# Altium project EVXXXX_02-01243_Drone_ESC_Ref_Design.PrjPCB (part 1 of 4)
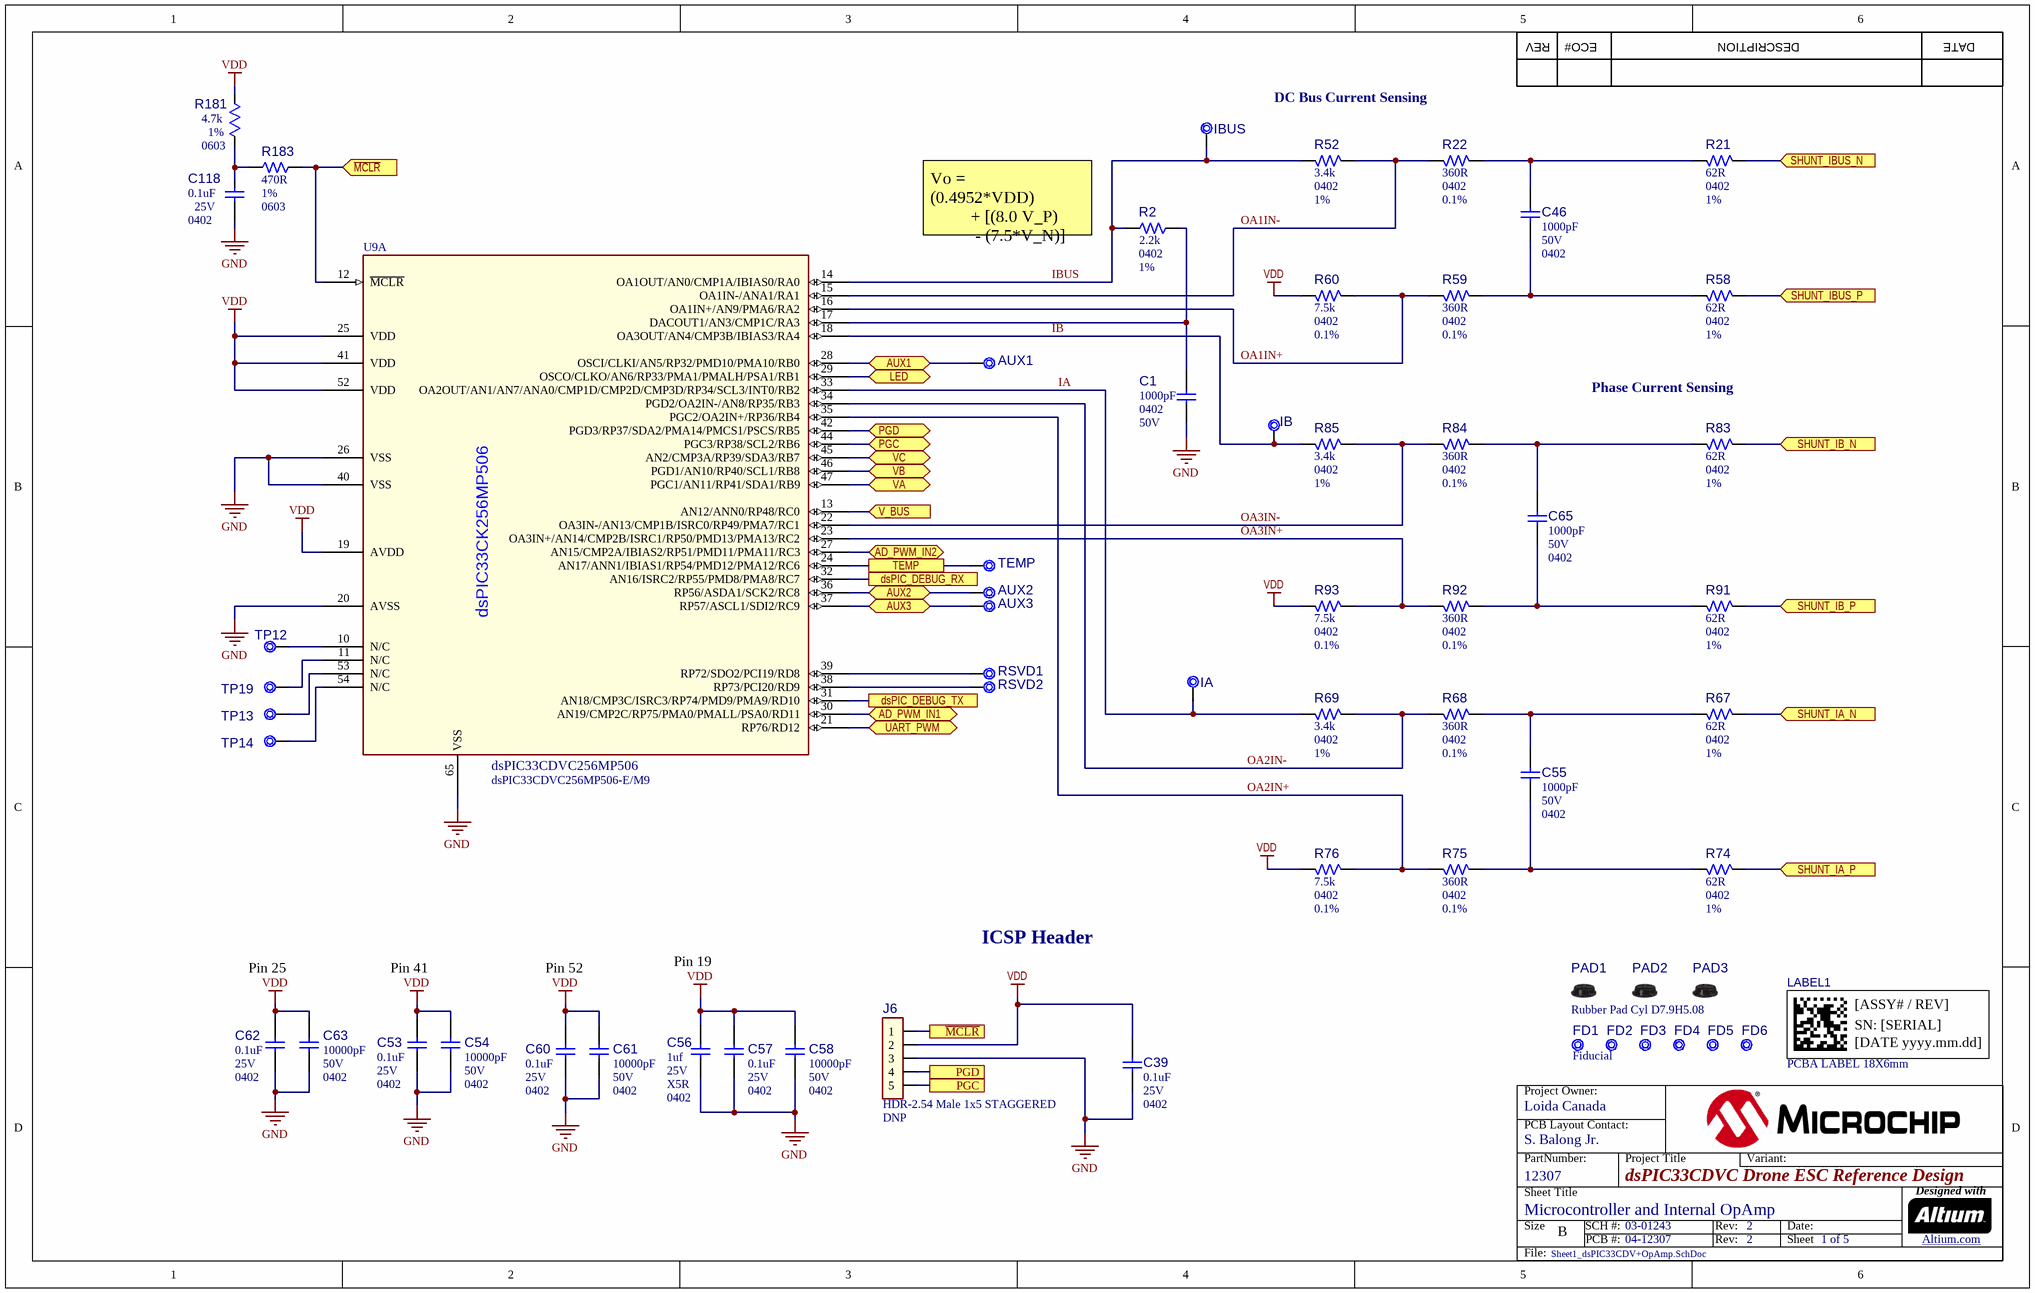
[diagram p0: Sheet1_dsPIC33CDV+OpAmp.SchDoc]
Date: 01-30-2026; ProjectDrawnBy: S. Balong Jr.; ProjectEngineer: Loida Canada; ProjectPartNumber: 12307; ProjectPCBAssyNumber: 01243; ProjectPCBAssyRevision: 2; ProjectPCBFabNumber: 12307; ProjectPCBFabRevision: 2; ProjectPCBNumber: 12307; ProjectRevision: 2; ProjectRevisionART: 2; ProjectRevisionASSY: 2; ProjectRevisionFAB: 2; ProjectRevisionSCH: 2; ProjectTitle: dsPIC33CDVC Drone ESC Reference Design
5 sheets, 174 parts. Net scope: flat (ports and power ports of the same name join across sheets).
Board file: 04-12307_Drone_ESC.PcbDoc
Sheets:
  Sheet1_dsPIC33CDV+OpAmp.SchDoc
  Sheet2_Inverter_GateDriver.SchDoc
  Sheet3_SenseCkts_Programming_Interface.SchDoc
  Sheet4_CAN_Interface.SchDoc
  Sheet5_RevHistory.SchDoc

## Sheet Sheet1_dsPIC33CDV+OpAmp.SchDoc
size B; CompanyName: Microchip Technology Inc.; Organization: Microchip Technology; Address1: 2355 West Chandler Blvd.; Address2: Chandler, AZ  85224; Address4: USA; DocumentNumber: 1; SheetNumber: 1; SheetTotal: 5; SheetTitle: Microcontroller and Internal OpAmp; Time: Time

### Parts
AUX1  Test Point No BOM  [CON_TP_SMD_D25mil_NoSilk]  (value not drawn)  (no BOM)
AUX2  Test Point No BOM  [TP_TH_0.7PADX0.4HOLE]  (value not drawn)  (no BOM)
AUX3  Test Point No BOM  [CON_TP_SMD_D25mil_NoSilk]  (value not drawn)  (no BOM)
C1  value 1000pF  Voltage: 50V  Package: 0402  [CAP_C_0402]  (hidden comment: Capacitor NP)
C39  value 0.1uF  Voltage: 25V  Package: 0402  [CAP_C_0402]  (hidden comment: Capacitor NP)
C46  value 1000pF  Voltage: 50V  Package: 0402  [CAP_C_0402]  (hidden comment: Capacitor NP)
C53  value 0.1uF  Voltage: 25V  Package: 0402  [CAP_C_0402]  (hidden comment: Capacitor NP)
C54  value 10000pF  Voltage: 50V  Package: 0402  [CAP_C_0402]  (hidden comment: Capacitor NP)
C55  value 1000pF  Voltage: 50V  Package: 0402  [CAP_C_0402]  (hidden comment: Capacitor NP)
C56  value 1uf  Voltage: 25V  Package: 0402  Temperature Coefficient: X5R  [CAP_C_0402]  (hidden comment: Capacitor NP)
C57  value 0.1uF  Voltage: 25V  Package: 0402  [CAP_C_0402]  (hidden comment: Capacitor NP)
C58  value 10000pF  Voltage: 50V  Package: 0402  [CAP_C_0402]  (hidden comment: Capacitor NP)
C60  value 0.1uF  Voltage: 25V  Package: 0402  [CAP_C_0402]  (hidden comment: Capacitor NP)
C61  value 10000pF  Voltage: 50V  Package: 0402  [CAP_C_0402]  (hidden comment: Capacitor NP)
C62  value 0.1uF  Voltage: 25V  Package: 0402  [CAP_C_0402]  (hidden comment: Capacitor NP)
C63  value 10000pF  Voltage: 50V  Package: 0402  [CAP_C_0402]  (hidden comment: Capacitor NP)
C65  value 1000pF  Voltage: 50V  Package: 0402  [CAP_C_0402]  (hidden comment: Capacitor NP)
C118  value 0.1uF  Voltage: 25V  Package: 0402  [CAP_C_0402]  (hidden comment: Capacitor NP)
FD1  value Fiducial  [Fiducial_1mm]  (hidden comment: FIDUCIAL ROUND)  (no BOM)
FD2  FIDUCIAL ROUND  [Fiducial_1mm]  (value not drawn)  (no BOM)
FD3  FIDUCIAL ROUND  [Fiducial_1mm]  (value not drawn)  (no BOM)
FD4  FIDUCIAL ROUND  [Fiducial_1mm]  (value not drawn)  (no BOM)
FD5  FIDUCIAL ROUND  [Fiducial_1mm]  (value not drawn)  (no BOM)
FD6  FIDUCIAL ROUND  [Fiducial_1mm]  (value not drawn)  (no BOM)
IA  Test Point No BOM  [CON_TP_SMD_D25mil_NoSilk]  (value not drawn)  (no BOM)
IB  Test Point No BOM  [CON_TP_SMD_D25mil_NoSilk]  (value not drawn)  (no BOM)
IBUS  Test Point No BOM  [TP_TH_0.7PADX0.4HOLE]  (value not drawn)  (no BOM)
J6  value HDR-2.54 Male 1x5 STAGGERED  Populated: DNP  [HDR_M_2.54_1x5_STAGGERED]
LABEL1  value PCBA LABEL 18X6mm  [08-10015]  (hidden comment: 08-10015)
PAD1  value Rubber Pad Cyl D7.9H5.08  [BUMP_3M_SJ61A1_CYLINDRICAL_BLACK_D7.9H5.08]  (hidden comment: Rubber Pad Cylindrical)
PAD2  Rubber Pad Cylindrical  [BUMP_3M_SJ61A1_CYLINDRICAL_BLACK_D7.9H5.08]  (value not drawn)
PAD3  Rubber Pad Cylindrical  [BUMP_3M_SJ61A1_CYLINDRICAL_BLACK_D7.9H5.08]  (value not drawn)
R2  value 2.2k  Package: 0402  Tolerance: 1%  [RES_C_0402]  (hidden comment: Resistor)
R21  value 62R  Package: 0402  Tolerance: 1%  [RES_C_0402]  (hidden comment: Resistor)
R22  value 360R  Package: 0402  Tolerance: 0.1%  [RES_C_0402]  (hidden comment: Resistor)
R52  value 3.4k  Package: 0402  Tolerance: 1%  [RES_C_0402]  (hidden comment: Resistor)
R58  value 62R  Package: 0402  Tolerance: 1%  [RES_C_0402]  (hidden comment: Resistor)
R59  value 360R  Package: 0402  Tolerance: 0.1%  [RES_C_0402]  (hidden comment: Resistor)
R60  value 7.5k  Package: 0402  Tolerance: 0.1%  [RES_C_0402]  (hidden comment: Resistor)
R67  value 62R  Package: 0402  Tolerance: 1%  [RES_C_0402]  (hidden comment: Resistor)
R68  value 360R  Package: 0402  Tolerance: 0.1%  [RES_C_0402]  (hidden comment: Resistor)
R69  value 3.4k  Package: 0402  Tolerance: 1%  [RES_C_0402]  (hidden comment: Resistor)
R74  value 62R  Package: 0402  Tolerance: 1%  [RES_C_0402]  (hidden comment: Resistor)
R75  value 360R  Package: 0402  Tolerance: 0.1%  [RES_C_0402]  (hidden comment: Resistor)
R76  value 7.5k  Package: 0402  Tolerance: 0.1%  [RES_C_0402]  (hidden comment: Resistor)
R83  value 62R  Package: 0402  Tolerance: 1%  [RES_C_0402]  (hidden comment: Resistor)
R84  value 360R  Package: 0402  Tolerance: 0.1%  [RES_C_0402]  (hidden comment: Resistor)
R85  value 3.4k  Package: 0402  Tolerance: 1%  [RES_C_0402]  (hidden comment: Resistor)
R91  value 62R  Package: 0402  Tolerance: 1%  [RES_C_0402]  (hidden comment: Resistor)
R92  value 360R  Package: 0402  Tolerance: 0.1%  [RES_C_0402]  (hidden comment: Resistor)
R93  value 7.5k  Package: 0402  Tolerance: 0.1%  [RES_C_0402]  (hidden comment: Resistor)
R181  value 4.7k  Tolerance: 1%  Package: 0603  [RES_C_0603]  (hidden comment: Resistor)
R183  value 470R  Tolerance: 1%  Package: 0603  [RES_C_0603]  (hidden comment: Resistor)
RSVD1  Test Point No BOM  [CON_TP_SMD_D25mil_NoSilk]  (value not drawn)  (no BOM)
RSVD2  Test Point No BOM  [CON_TP_SMD_D25mil_NoSilk]  (value not drawn)  (no BOM)
TEMP  Test Point No BOM  [TP_TH_0.7PADX0.4HOLE]  (value not drawn)  (no BOM)
TP12  Test Point No BOM  [CON_TP_SMD_D25mil_NoSilk]  (value not drawn)  (no BOM)
TP13  Test Point No BOM  [CON_TP_SMD_D25mil_NoSilk]  (value not drawn)  (no BOM)
TP14  Test Point No BOM  [CON_TP_SMD_D25mil_NoSilk]  (value not drawn)  (no BOM)
TP19  Test Point No BOM  [CON_TP_SMD_D25mil_NoSilk]  (value not drawn)  (no BOM)
U9  value dsPIC33CDVC256MP506-E/M9  [QFN-64_9X9_3EP_M9]  (hidden comment: dsPIC33CDVC256MP506_VGQFN-64)  (part A of 3)

### Ports
AD_PWM_IN1 (bidir), AD_PWM_IN2 (bidir), AUX1 (bidir), AUX2 (bidir), AUX3 (bidir), dsPIC_DEBUG_RX, dsPIC_DEBUG_TX, LED (bidir), PGC, PGC (bidir), PGD, PGD (bidir), SHUNT_IA_N (in), SHUNT_IA_P (in), SHUNT_IB_N (in), SHUNT_IB_P (in), SHUNT_IBUS_N (in), SHUNT_IBUS_P (in), TEMP, UART_PWM (bidir), V_BUS (in), VA (bidir), VB (bidir), VC (bidir), ~{MCLR}, ~{MCLR} (in)

### Nets
GND: C1.2 C39.1 C53.1 C54.1 C56.1 C57.1 C58.1 C60.1 C61.1 C62.1 C63.1 C118.1 J6.3 U9.20(AVSS) U9.26(VSS) U9.40(VSS) U9.65(VSS)
VDD: C39.2 C53.2 C54.2 C56.2 C57.2 C58.2 C60.2 C61.2 C62.2 C63.2 J6.2 R60.2 R76.2 R93.2 R181.1 U9.19(AVDD) U9.25(VDD) U9.41(VDD) U9.52(VDD)
AD_PWM_IN1: U9.30(AN19/CMP2C/RP75/PMA0/PMALL/PSA0/RD11) ; port AD_PWM_IN1
AD_PWM_IN2: U9.27(AN15/CMP2A/IBIAS2/RP51/PMD11/PMA11/RC3) ; port AD_PWM_IN2
AUX1: AUX1.1 U9.28(OSCI/CLKI/AN5/RP32/PMD10/PMA10/RB0) ; port AUX1
AUX2: AUX2.1 U9.36(RP56/ASDA1/SCK2/RC8) ; port AUX2
AUX3: AUX3.1 U9.37(RP57/ASCL1/SDI2/RC9) ; port AUX3
dsPIC_DEBUG_RX: U9.32(AN16/ISRC2/RP55/PMD8/PMA8/RC7) ; port dsPIC_DEBUG_RX
dsPIC_DEBUG_TX: U9.31(AN18/CMP3C/ISRC3/RP74/PMD9/PMA9/RD10) ; port dsPIC_DEBUG_TX
IA: IA.1 R69.2 U9.33(OA2OUT/AN1/AN7/ANA0/CMP1D/CMP2D/CMP3D/RP34/SCL3/INT0/RB2)
IB: IB.1 R85.2 U9.18(OA3OUT/AN4/CMP3B/IBIAS3/RA4)
IBUS: IBUS.1 R2.1 R52.2 U9.14(OA1OUT/AN0/CMP1A/IBIAS0/RA0)
LED: U9.29(OSCO/CLKO/AN6/RP33/PMA1/PMALH/PSA1/RB1) ; port LED
~{MCLR}: J6.1 R183.2 U9.12(~{MCLR}) ; port ~{MCLR}
OA1IN+: R59.2 R60.1 U9.16(OA1IN+/AN9/PMA6/RA2)
OA1IN-: R22.2 R52.1 U9.15(OA1IN-/ANA1/RA1)
OA2IN+: R75.2 R76.1 U9.35(PGC2/OA2IN+/RP36/RB4)
OA2IN-: R68.2 R69.1 U9.34(PGD2/OA2IN-/AN8/RP35/RB3)
OA3IN+: R92.2 R93.1 U9.23(OA3IN+/AN14/CMP2B/ISRC1/RP50/PMD13/PMA13/RC2)
OA3IN-: R84.2 R85.1 U9.22(OA3IN-/AN13/CMP1B/ISRC0/RP49/PMA7/RC1)
PGC: J6.5 U9.44(PGC3/RP38/SCL2/RB6) ; port PGC
PGD: J6.4 U9.42(PGD3/RP37/SDA2/PMA14/PMCS1/PSCS/RB5) ; port PGD
SHUNT_IA_N: R67.1 ; port SHUNT_IA_N
SHUNT_IA_P: R74.1 ; port SHUNT_IA_P
SHUNT_IB_N: R83.1 ; port SHUNT_IB_N
SHUNT_IB_P: R91.1 ; port SHUNT_IB_P
SHUNT_IBUS_N: R21.1 ; port SHUNT_IBUS_N
SHUNT_IBUS_P: R58.1 ; port SHUNT_IBUS_P
TEMP: TEMP.1 U9.24(AN17/ANN1/IBIAS1/RP54/PMD12/PMA12/RC6) ; port TEMP
UART_PWM: U9.21(RP76/RD12) ; port UART_PWM
V_BUS: U9.13(AN12/ANN0/RP48/RC0) ; port V_BUS
VA: U9.47(PGC1/AN11/RP41/SDA1/RB9) ; port VA
VB: U9.46(PGD1/AN10/RP40/SCL1/RB8) ; port VB
VC: U9.45(AN2/CMP3A/RP39/SDA3/RB7) ; port VC
NetC1_1: C1.1 R2.2 U9.17(DACOUT1/AN3/CMP1C/RA3)
NetC46_1: C46.1 R58.2 R59.1
NetC46_2: C46.2 R21.2 R22.1
NetC55_1: C55.1 R74.2 R75.1
NetC55_2: C55.2 R67.2 R68.1
NetC65_1: C65.1 R91.2 R92.1
NetC65_2: C65.2 R83.2 R84.1
NetC118_2: C118.2 R181.2 R183.1
NetRSVD1_1: RSVD1.1 U9.39(RP72/SDO2/PCI19/RD8)
NetRSVD2_1: RSVD2.1 U9.38(RP73/PCI20/RD9)
NetTP12_1: TP12.1 U9.10(N/C)
NetTP13_1: TP13.1 U9.53(N/C)
NetTP14_1: TP14.1 U9.54(N/C)
NetTP19_1: TP19.1 U9.11(N/C)

Not connected (* = marked no-connect by the designer): FD1 1; FD2 1; FD3 1; FD4 1; FD5 1; FD6 1

### Notes on the sheet
- DC Bus Current Sensing
- REV
- ECO#
- DESCRIPTION
- DATE
- (near R2) Vo =    (0.4952*VDD)
  + [(8.0 V_P)
  - (7.5*V_N)]
- (near R84) Phase Current Sensing
- (near U9) dsPIC33CDVC256MP506
- Pin 25
- Pin 41
- Pin 52
- Pin 19
- ICSP Header
- Project Owner:
- PCB Layout Contact:
- PartNumber:
- Project Title
- Variant:
- Sheet Title
- Size
- B
- SCH #:
- PCB #:
- Rev:
- Date:
- Sheet
- Designed with
- Altium.com <http://go.altium.com/MicrochipLandingPage_Evaluation.html>
- File:
- (in symbol 08-10015) [ASSY# / REV]; SN: [SERIAL]; [DATE yyyy.mm.dd]
- (in symbol MIC9437, part A) dsPIC33CK256MP506

### Library data of the parts
AUX1 AUX3 RSVD1 RSVD2 = CON3082: Test Point; Description_: CON TP PAD PCB SMD D25mil; Dev Tools Status: Design; Owner: James Boomer; Populated: YES; Value: TP SMD D25mil; MCHP-ID: CON3082; Revision: 1; Symbol: Test Point No BOM; Status: MCL Design; ComponentLink1Description: SVN Datasheet; ComponentLink2Description: Local Datasheet; ComponentLink3URL: C:\ALTIUM_WORK\00001_MCHP-CDB\Library\LibraryRefs\Test Point No BOM.SchLib; ComponentLink3Description: Open Symbol; ComponentLink4URL: C:\ALTIUM_WORK\00001_MCHP-CDB\Library\Footprints\CON_TP_SMD_D25mil_NoSilk.PcbLib; ComponentLink4Description: Open Footprint; ComponentLink5Description: Open Footprint 2; ComponentLink6Description: Open Footprint 3; ComponentLink7Description: Open Footprint 4; Type: Test Point No BOM; Category: Connector; Quantity Override: 1; Assembly Type: SMD; Restricted Sourcing: No
AUX2 TEMP = CON2938: Test Point; Description_: CON TP PAD PCB TH D0.7H0.4; Dev Tools Status: Design; Owner: Severino Balong Jr.; Populated: DNP; MCHP-ID: CON2938; Revision: 1; Symbol: Test Point No BOM; Status: MCL Design; ComponentLink1Description: SVN Datasheet; ComponentLink2Description: Local Datasheet; ComponentLink3URL: C:\ALTIUM_WORK\00001_MCHP-CDB\Library\LibraryRefs\Test Point No BOM.SchLib; ComponentLink3Description: Open Symbol; ComponentLink4URL: C:\ALTIUM_WORK\00001_MCHP-CDB\Library\Footprints\TP_TH_0.7PADX0.4HOLE.PcbLib; ComponentLink4Description: Open Footprint; ComponentLink5Description: Open Footprint 2; ComponentLink6Description: Open Footprint 3; ComponentLink7Description: Open Footprint 4; Type: Test Point No BOM; Category: Connector; Quantity Override: 1; Assembly Type: TH; Restricted Sourcing: No
C1 C46 C55 C65 = CAP2655: Manufacturer 1: KEMET; Manufacturer Part Number 1: C0402C102J5GAC7867; Description_: CAP CER 1000pF 50V 5% NP0 SMD 0402; Dev Tools Status: Production; Tolerance: 5%; Type: Ceramic; Populated: YES; Temperature Coefficient: C0G, NP0; Owner: Narasimha Murthy; Restricted Sourcing: No; MCHP-ID: CAP2655; Revision: 2; Symbol: Capacitor NP; Status: MCL Design; ComponentLink1URL: https://chn-vm-apps.microchip.com/mchprepo/parts/Datasheets/GRM1555C1H102JA01D.pdf; ComponentLink1Description: SVN Datasheet; ComponentLink2URL: C:\ALTIUM_WORK\00001_MCHP-CDB\Datasheets\GRM1555C1H102JA01D.pdf; ComponentLink2Description: Local Datasheet; ComponentLink3URL: C:\ALTIUM_WORK\00001_MCHP-CDB\Library\LibraryRefs\Capacitor NP.SchLib; ComponentLink3Description: Open Symbol; ComponentLink4URL: C:\ALTIUM_WORK\00001_MCHP-CDB\Library\Footprints\CAP_C_0402.PcbLib; ComponentLink4Description: Open Footprint; ComponentLink5Description: Open Footprint 2; ComponentLink6Description: Open Footprint 3; ComponentLink7Description: Open Footprint 4; Operating Temperature: -55C to +125C; Category: Capacitor; Manufacturer 2: Murata; Manufacturer Part Number 2: GRM1555C1H102JA01D; Supplier 1: Digi-Key; Supplier Part Number 1: 399-C0402C102J5GAC7867TR-ND; Supplier 2: Digi-Key; Supplier Part Number 2: 490-3244-2-ND; Quantity Override: 1
C39 C53 C57 C60 C62 C118 = CAP1345: Manufacturer 1: TDK Corporation; Manufacturer Part Number 1: C1005X7R1E104K050BB; Description_: CAP CER 0.1uF 25V 10% X7R SMD 0402; Dev Tools Status: Production; Tolerance: 10%; Type: Ceramic; Owner: Randolph Sobrepena; Populated: YES; Temperature Coefficient: X7R; Restricted Sourcing: No; MCHP-ID: CAP1345; Revision: 2; Symbol: Capacitor NP; Status: MCL Design; ComponentLink1URL: https://chn-vm-apps.microchip.com/mchprepo/parts/Datasheets/mlcc_commercial_general_en; ComponentLink1Description: SVN Datasheet; ComponentLink2URL: C:\ALTIUM_WORK\00001_MCHP-CDB\Datasheets\mlcc_commercial_general_en; ComponentLink2Description: Local Datasheet; ComponentLink3URL: C:\ALTIUM_WORK\00001_MCHP-CDB\Library\LibraryRefs\Capacitor NP.SchLib; ComponentLink3Description: Open Symbol; ComponentLink4URL: C:\ALTIUM_WORK\00001_MCHP-CDB\Library\Footprints\CAP_C_0402.PcbLib; ComponentLink4Description: Open Footprint; ComponentLink5Description: Open Footprint 2; ComponentLink6Description: Open Footprint 3; ComponentLink7Description: Open Footprint 4; Operating Temperature: -55°C to 125°C; Category: Capacitor; Supplier 1: Digi-Key; Supplier Part Number 1: 445-7348-1-ND; Quantity Override: 1
C54 C58 C61 C63 = CAP1071: Manufacturer 1: Yageo; Manufacturer Part Number 1: CC0402KRX7R9BB103; Description_: CAP CER 10000pF 50V 10% X7R SMD 0402; Dev Tools Status: Production; Tolerance: 10%; Type: Ceramic; Populated: YES; Temperature Coefficient: X7R; Owner: Tad Ahlvers; Restricted Sourcing: No; MCHP-ID: CAP1071; Revision: 4; Symbol: Capacitor NP; Status: MCL Design; ComponentLink1URL: https://chn-vm-apps.microchip.com/mchprepo/parts/Datasheets/UPY-GPHC_X7R_6.3V-to-50V_8.pdf; ComponentLink1Description: SVN Datasheet; ComponentLink2URL: C:\ALTIUM_WORK\00001_MCHP-CDB\Datasheets\UPY-GPHC_X7R_6.3V-to-50V_8.pdf; ComponentLink2Description: Local Datasheet; ComponentLink3URL: C:\ALTIUM_WORK\00001_MCHP-CDB\Library\LibraryRefs\Capacitor NP.SchLib; ComponentLink3Description: Open Symbol; ComponentLink4URL: C:\ALTIUM_WORK\00001_MCHP-CDB\Library\Footprints\CAP_C_0402.PcbLib; ComponentLink4Description: Open Footprint; ComponentLink5Description: Open Footprint 2; ComponentLink6Description: Open Footprint 3; ComponentLink7Description: Open Footprint 4; Operating Temperature: -55C to +125C; Category: Capacitor; Manufacturer 2: Samsung Electro-Mechanics; Manufacturer Part Number 2: CL05B103KB5NNN; Supplier 1: Digi-Key; Supplier Part Number 1: 311-1349-2-ND; Supplier 2: Samsung Electro-Mechanics; Supplier Part Number 2: CL05B103KB5NNN; Quantity Override: 1
C56 = CAP2425: Manufacturer 1: TDK Corporation; Manufacturer Part Number 1: CGB2A1X5R1E105K033BC; Description_: 1UF 0402 CER 25V 10% X5R; Dev Tools Status: Design; Tolerance: 10%; Type: Ceramic; Owner: Tim Moffat; Populated: YES; MCHP-ID: CAP2425; Revision: 1; Symbol: Capacitor NP; Status: MCL Design; ComponentLink1URL: https://chn-vm-apps.microchip.com/mchprepo/parts/Datasheets/mlcc_commercial_lowprofile_en.pdf; ComponentLink1Description: SVN Datasheet; ComponentLink2URL: C:\ALTIUM_WORK\00001_MCHP-CDB\Datasheets\mlcc_commercial_lowprofile_en.pdf; ComponentLink2Description: Local Datasheet; ComponentLink3URL: C:\ALTIUM_WORK\00001_MCHP-CDB\Library\LibraryRefs\Capacitor NP.SchLib; ComponentLink3Description: Open Symbol; ComponentLink4URL: C:\ALTIUM_WORK\00001_MCHP-CDB\Library\Footprints\CAP_C_0402.PcbLib; ComponentLink4Description: Open Footprint; ComponentLink5Description: Open Footprint 2; ComponentLink6Description: Open Footprint 3; ComponentLink7Description: Open Footprint 4; Operating Temperature: -55C to +85C; Category: Capacitor; Supplier 1: Digi-Key; Supplier Part Number 1: 445-13185-1-ND; Quantity Override: 1; Restricted Sourcing: Yes
FD1-FD6 = MECH0282: Fiducial; Description_: FIDUCIAL ROUND PCB 1mm SMD; Dev Tools Status: Production; Owner: Dragos Danaila; Populated: MECH; MCHP-ID: MECH0282; Revision: 1; Symbol: FIDUCIAL ROUND; Status: MCL Design; ComponentLink1Description: SVN Datasheet; ComponentLink2Description: Local Datasheet; ComponentLink3URL: C:\ALTIUM_WORK\00001_MCHP-CDB\Library\LibraryRefs\FIDUCIAL ROUND.SchLib; ComponentLink3Description: Open Symbol; ComponentLink4URL: C:\ALTIUM_WORK\00001_MCHP-CDB\Library\Footprints\Fiducial_1mm.PcbLib; ComponentLink4Description: Open Footprint; ComponentLink5Description: Open Footprint 2; ComponentLink6Description: Open Footprint 3; ComponentLink7Description: Open Footprint 4; Type: Fiducial; Category: Hardware; Quantity Override: 1
  FD2-FD6: Value: Fiducial
IA IB TP12-TP14 TP19 = CON3082: Test Point; Description_: CON TP PAD PCB SMD D25mil; Owner: James Boomer; Populated: YES; Dev Tools Status: Design; Value: TP SMD D25mil; MCHP-ID: CON3082; Revision: 1; Status: MCL Design; Category: Connector; Quantity Override: 1; ComponentLink1Description: SVN Datasheet; Type: Test Point No BOM; Symbol: Test Point No BOM; ComponentLink2Description: Local Datasheet; ComponentLink3URL: C:\ALTIUM_WORK\00001_MCHP-CDB\Library\LibraryRefs\Test Point No BOM.SchLib; ComponentLink3Description: Open Symbol; ComponentLink4URL: C:\ALTIUM_WORK\00001_MCHP-CDB\Library\Footprints\CON_TP_SMD_D25mil_NoSilk.PcbLib; ComponentLink4Description: Open Footprint; ComponentLink5Description: Open Footprint 2; ComponentLink6Description: Open Footprint 3; ComponentLink7Description: Open Footprint 4; Assembly Type: SMD; Restricted Sourcing: No
IBUS = CON2938: Test Point; Description_: CON TP PAD PCB TH D0.7H0.4; Owner: Severino Balong Jr.; Populated: DNP; Dev Tools Status: Design; MCHP-ID: CON2938; Revision: 1; Status: MCL Design; Category: Connector; Quantity Override: 1; ComponentLink1Description: SVN Datasheet; Type: Test Point No BOM; Symbol: Test Point No BOM; ComponentLink2Description: Local Datasheet; ComponentLink3URL: C:\ALTIUM_WORK\00001_MCHP-CDB\Library\LibraryRefs\Test Point No BOM.SchLib; ComponentLink3Description: Open Symbol; ComponentLink4URL: C:\ALTIUM_WORK\00001_MCHP-CDB\Library\Footprints\TP_TH_0.7PADX0.4HOLE.PcbLib; ComponentLink4Description: Open Footprint; ComponentLink5Description: Open Footprint 2; ComponentLink6Description: Open Footprint 3; ComponentLink7Description: Open Footprint 4; Assembly Type: TH; Restricted Sourcing: No
J6 = CON3170: Manufacturer 1: Sullins Connector Solutions; Manufacturer Part Number 1: PRPC005SGAN-M71RC; Description_: CON HDR-2.54 Male 1x5 8.08MH TH R/A DNP; Dev Tools Status: Design; Restricted Sourcing: No; Owner: Severino Balong Jr.; Current: 3A; MCHP-ID: CON3170; Revision: 1; Symbol: Header 1x5; Status: MCL Design; ComponentLink1URL: https://chn-vm-apps.microchip.com/mchprepo/parts/Datasheets/x RxCxxxSxxN-M71RC_ 11637-B.pdf; ComponentLink1Description: SVN Datasheet; ComponentLink2URL: C:\ALTIUM_WORK\00001_MCHP-CDB\Datasheets\x RxCxxxSxxN-M71RC_ 11637-B.pdf; ComponentLink2Description: Local Datasheet; ComponentLink3URL: C:\ALTIUM_WORK\00001_MCHP-CDB\Library\LibraryRefs\Header 1x5.SchLib; ComponentLink3Description: Open Symbol; ComponentLink4URL: C:\ALTIUM_WORK\00001_MCHP-CDB\Library\Footprints\HDR_M_2.54_1x5_STAGGERED.PcbLib; ComponentLink4Description: Open Footprint; ComponentLink5Description: Open Footprint 2; ComponentLink6Description: Open Footprint 3; ComponentLink7Description: Open Footprint 4; Type: Header 2.54mm; Category: Connector; Supplier 1: Digi-Key; Supplier Part Number 1: S1311EC-05-ND; Quantity Override: 1; Operating Temperature: -40C to +105C; Assembly Type: TH
LABEL1 = 08-10015: Manufacturer 1: ACT Logimark AS; Manufacturer Part Number 1: 505462; Description_: LABEL PCBA 18x6mm Datamatrix Assy# / Rev / Serial / Date; Dev Tools Status: Production; Owner: Mark Loper; Populated: MECH; MCHP-ID: 08-10015; Revision: 4; Symbol: 08-10015; Status: MCL Design; ComponentLink1Description: SVN Datasheet; ComponentLink2Description: Local Datasheet; ComponentLink3URL: C:\ALTIUM_WORK\00001_MCHP-CDB\Library\LibraryRefs\08-10015.SchLib; ComponentLink3Description: Open Symbol; ComponentLink4URL: C:\ALTIUM_WORK\00001_MCHP-CDB\Library\Footprints\08-10015.PcbLib; ComponentLink4Description: Open Footprint; ComponentLink5Description: Open Footprint 2; ComponentLink6Description: Open Footprint 3; ComponentLink7Description: Open Footprint 4; Type: PCBA Label; Category: MCHP-Manufacturing; Manufacturer 2: Sunrise Paper (M) Sdn Bhd; Manufacturer Part Number 2: 037268-5; Manufacturer 3: Raynen; Manufacturer Part Number 3: 10010407; Supplier 1: ACT Logimark AS; Supplier Part Number 1: 505462; Supplier 2: Microchip Technology; Supplier Part Number 2: 01000-004967; Supplier 3: Raynen; Supplier Part Number 3: 10010407; Quantity Override: 1
PAD1 = MISC1024: Manufacturer 1: 3M; Manufacturer Part Number 1: SJ61A1; Description_: MECH HW RUBBER PAD CYLINDRICAL D7.9 H5.08 BLACK; Dev Tools Status: Production; Owner: Bogdan Popescu; Populated: MECH; MCHP-ID: MISC1024; Revision: 4; Symbol: Rubber Pad Cylindrical; Status: MCL Design; ComponentLink1URL: https://chn-vm-apps.microchip.com/mchprepo/parts/Datasheets/SJxxA1.pdf; ComponentLink1Description: SVN Datasheet; ComponentLink2URL: C:\ALTIUM_WORK\00001_MCHP-CDB\Datasheets\SJxxA1.pdf; ComponentLink2Description: Local Datasheet; ComponentLink3URL: C:\ALTIUM_WORK\00001_MCHP-CDB\Library\LibraryRefs\Rubber Pad Cylindrical.SchLib; ComponentLink3Description: Open Symbol; ComponentLink4URL: C:\ALTIUM_WORK\00001_MCHP-CDB\Library\Footprints\BUMP_3M_SJ61A1_CYLINDRICAL_BLACK_D7.9H5.08.PcbLib; ComponentLink4Description: Open Footprint; ComponentLink5Description: Open Footprint 2; ComponentLink6Description: Open Footprint 3; ComponentLink7Description: Open Footprint 4; Type: Rubber Pad; Category: Hardware; Supplier 1: Digi-Key; Supplier Part Number 1: SJ5746-0-ND; Quantity Override: 1
PAD2 PAD3 = MISC1024: Manufacturer 1: 3M; Manufacturer Part Number 1: SJ61A1; Value: Rubber Pad Cyl D7.9H5.08; Description_: MECH HW RUBBER PAD CYLINDRICAL D7.9 H5.08 BLACK; Dev Tools Status: Production; Owner: Bogdan Popescu; Populated: MECH; MCHP-ID: MISC1024; Revision: 4; Symbol: Rubber Pad Cylindrical; Status: MCL Design; ComponentLink1URL: https://chn-vm-apps.microchip.com/mchprepo/parts/Datasheets/SJxxA1.pdf; ComponentLink1Description: SVN Datasheet; ComponentLink2URL: C:\ALTIUM_WORK\00001_MCHP-CDB\Datasheets\SJxxA1.pdf; ComponentLink2Description: Local Datasheet; ComponentLink3URL: C:\ALTIUM_WORK\00001_MCHP-CDB\Library\LibraryRefs\Rubber Pad Cylindrical.SchLib; ComponentLink3Description: Open Symbol; ComponentLink4URL: C:\ALTIUM_WORK\00001_MCHP-CDB\Library\Footprints\BUMP_3M_SJ61A1_CYLINDRICAL_BLACK_D7.9H5.08.PcbLib; ComponentLink4Description: Open Footprint; ComponentLink5Description: Open Footprint 2; ComponentLink6Description: Open Footprint 3; ComponentLink7Description: Open Footprint 4; Type: Rubber Pad; Category: Hardware; Supplier 1: Digi-Key; Supplier Part Number 1: SJ5746-0-ND; Quantity Override: 1
R2 = RES1023: Manufacturer 1: Panasonic; Manufacturer Part Number 1: ERJ-2RKF2201X; Description_: RES TKF 2.2k 1% 1/10W SMD 0402; Dev Tools Status: Production; Voltage: 50V; Temperature Coefficient: 100ppm/C; Power: 1/10W; Owner: Tad Ahlvers; Populated: YES; MCHP-ID: RES1023; Revision: 1; Symbol: Resistor; Status: MCL Design; ComponentLink1URL: https://chn-vm-apps.microchip.com/mchprepo/parts/Datasheets/AOA0000CE2.pdf; ComponentLink1Description: SVN Datasheet; ComponentLink2URL: C:\ALTIUM_WORK\00001_MCHP-CDB\Datasheets\AOA0000CE2.pdf; ComponentLink2Description: Local Datasheet; ComponentLink3URL: C:\ALTIUM_WORK\00001_MCHP-CDB\Library\LibraryRefs\Resistor.SchLib; ComponentLink3Description: Open Symbol; ComponentLink4URL: C:\ALTIUM_WORK\00001_MCHP-CDB\Library\Footprints\RES_C_0402.PcbLib; ComponentLink4Description: Open Footprint; ComponentLink5Description: Open Footprint 2; ComponentLink6Description: Open Footprint 3; ComponentLink7Description: Open Footprint 4; Operating Temperature: -55C to +155C; Category: Resistor; Type: RES SMD; Composition: TKF; Supplier 1: Digi-Key; Supplier Part Number 1: P2.20KLTR-ND; Quantity Override: 1
R21 R58 R67 R74 R83 R91 = RSMT1213: Manufacturer 1: Stackpole Electronics Inc; Manufacturer Part Number 1: RMCF0402FT62R0; Description_: RES TKF 62R 1% 1/16W SMD 0402 AEC-Q200; Dev Tools Status: Design; Voltage: 50V; Power: 1/16W; Populated: YES; Temperature Coefficient: 100ppm/C; Owner: Dragos Danaila; Restricted Sourcing: No; MCHP-ID: RSMT1213; Revision: C; Symbol: Resistor; Status: MCL Design; ComponentLink1URL: https://chn-vm-apps.microchip.com/mchprepo/parts/Datasheets/dcrcwe3.pdf; ComponentLink1Description: SVN Datasheet; ComponentLink2URL: C:\ALTIUM_WORK\00001_MCHP-CDB\Datasheets\dcrcwe3.pdf; ComponentLink2Description: Local Datasheet; ComponentLink3URL: C:\ALTIUM_WORK\00001_MCHP-CDB\Library\LibraryRefs\Resistor.SchLib; ComponentLink3Description: Open Symbol; ComponentLink4URL: C:\ALTIUM_WORK\00001_MCHP-CDB\Library\Footprints\RES_C_0402.PcbLib; ComponentLink4Description: Open Footprint; ComponentLink5Description: Open Footprint 2; ComponentLink6Description: Open Footprint 3; ComponentLink7Description: Open Footprint 4; Operating Temperature: -55C to +155C; Category: Resistor; Type: RES SMD; Composition: TKF; Supplier 1: Digi-Key; Supplier Part Number 1: RMCF0402FT62R0CT-ND; Quantity Override: 1; Manufacturer 2: Yageo; Manufacturer Part Number 2: AC0402FR-0762RL; Manufacturer 3: Vishay; Manufacturer Part Number 3: CRCW040262R0FKED; Supplier 2: Digi-Key; Supplier Part Number 2: 13-AC0402FR-0762RLCT-ND; Supplier 3: Digi-Key; Supplier Part Number 3: 541-62.0LCT-ND
R22 R59 R68 R75 R84 R92 = RES2221: Manufacturer 1: Yageo; Manufacturer Part Number 1: RT0402BRD07360RL; Description_: RES TKF 360R 0.1% 0.1W SMD 0402; Dev Tools Status: Design; Power: 1/10W; Owner: Cristian Papuc; Populated: YES; Voltage: 50V; Temperature Coefficient: 25ppm/C; Restricted Sourcing: No; MCHP-ID: RES2221; Revision: B; Symbol: Resistor; Status: MCL Design; ComponentLink1URL: https://chn-vm-apps.microchip.com/mchprepo/parts/Datasheets/PYu-RT_1-to-0.01_RoHS_L_9-1.pdf; ComponentLink1Description: SVN Datasheet; ComponentLink2URL: C:\ALTIUM_WORK\00001_MCHP-CDB\Datasheets\PYu-RT_1-to-0.01_RoHS_L_9-1.pdf; ComponentLink2Description: Local Datasheet; ComponentLink3URL: C:\ALTIUM_WORK\00001_MCHP-CDB\Library\LibraryRefs\Resistor.SchLib; ComponentLink3Description: Open Symbol; ComponentLink4URL: C:\ALTIUM_WORK\00001_MCHP-CDB\Library\Footprints\RES_C_0402.PcbLib; ComponentLink4Description: Open Footprint; ComponentLink5Description: Open Footprint 2; ComponentLink6Description: Open Footprint 3; ComponentLink7Description: Open Footprint 4; Operating Temperature: -55C to +155C; Category: Resistor; Type: RES SMD; Composition: TKF; Supplier 1: Digi-Key; Supplier Part Number 1: YAG1413CT-ND; Quantity Override: 1
R52 R69 R85 = RES3368: Manufacturer 1: Panasonic; Manufacturer Part Number 1: ERJ-2RKF3401X; Description_: RES TKF 3.4k 1% 1/10W SMD 0402 AEC-Q200; Dev Tools Status: Design; Power: 1/10W; Owner: Deepak Kariyappa; Populated: Yes; Voltage: 50V; Temperature Coefficient: 100ppm/C; Restricted Sourcing: No; MCHP-ID: RES3368; Revision: 2; Symbol: Resistor; Status: MCL Design; ComponentLink1URL: https://chn-vm-apps.microchip.com/mchprepo/parts/Datasheets/AOA0000C304.pdf; ComponentLink1Description: SVN Datasheet; ComponentLink2URL: C:\ALTIUM_WORK\00001_MCHP-CDB\Datasheets\AOA0000C304.pdf; ComponentLink2Description: Local Datasheet; ComponentLink3URL: C:\ALTIUM_WORK\00001_MCHP-CDB\Library\LibraryRefs\Resistor.SchLib; ComponentLink3Description: Open Symbol; ComponentLink4URL: C:\ALTIUM_WORK\00001_MCHP-CDB\Library\Footprints\RES_C_0402.PcbLib; ComponentLink4Description: Open Footprint; ComponentLink5Description: Open Footprint 2; ComponentLink6Description: Open Footprint 3; ComponentLink7Description: Open Footprint 4; Operating Temperature: –55C to 155C; Category: Resistor; Type: RES SMD; Composition: TKF; Supplier 1: Digi-Key; Supplier Part Number 1: P3.40KLTR-ND; Quantity Override: 1
R60 R76 R93 = RES3451: Manufacturer 1: Panasonic; Manufacturer Part Number 1: ERA-2AEB752X; Description_: RES TF 7.5k 0.1% 1/16W SMD 0402 AEC-Q200; Dev Tools Status: Production; Power: 1/16W; Owner: Narasimha Murthy; Populated: YES; Temperature Coefficient: 25ppm/C; Restricted Sourcing: No; MCHP-ID: RES3451; Revision: 1; Symbol: Resistor; Status: MCL Design; ComponentLink1URL: https://chn-vm-apps.microchip.com/mchprepo/parts/Datasheets/AOA0000C307.pdf; ComponentLink1Description: SVN Datasheet; ComponentLink2URL: C:\ALTIUM_WORK\00001_MCHP-CDB\Datasheets\AOA0000C307.pdf; ComponentLink2Description: Local Datasheet; ComponentLink3URL: C:\ALTIUM_WORK\00001_MCHP-CDB\Library\LibraryRefs\Resistor.SchLib; ComponentLink3Description: Open Symbol; ComponentLink4URL: C:\ALTIUM_WORK\00001_MCHP-CDB\Library\Footprints\RES_C_0402.PcbLib; ComponentLink4Description: Open Footprint; ComponentLink5Description: Open Footprint 2; ComponentLink6Description: Open Footprint 3; ComponentLink7Description: Open Footprint 4; Operating Temperature: -55C to +155C; Category: Resistor; Type: RES SMD; Composition: TF; Supplier 1: Digi-Key; Supplier Part Number 1: P7.5KDCCT-ND; Quantity Override: 1; Manufacturer 2: Yageo; Manufacturer Part Number 2: RP0402BRD077K5L; Supplier 2: Digi-Key; Supplier Part Number 2: 13-RP0402BRD077K5LCT-ND
R181 = RSMT0628: Manufacturer Part Number 1: ERJ-3EKF4701V; Manufacturer 1: Panasonic; Populated: Yes; Power: 1/10W; Voltage: 75V; Description_: RES TKF 4.7k 1% 1/10W SMD 0603; Temperature Coeffcient: 100ppm/C; Type: RES SMD; MCHP-ID: RSMT0628; Supplier 1: Digi-Key; Supplier Part Number 1: P4.70KHCT-ND; ComponentLink1Description: Datasheet; Status: Production; Quantity Override: 1; Revision: 1; ComponentLink1URL: https://chn-vm-apps.microchip.com/mchprepo/parts/Datasheets/AOA0000CE2.pdf; Operating Temperature: -55C to +155C; Category: Resistor; Composition: TKF
R183 = RSMT0518: Manufacturer Part Number 1: RC0603FR-07470RL; Manufacturer 1: Yageo; Populated: Yes; Power: 1/10W; Voltage: 50V; Description_: RES TKF 470R 1% 1/10W SMD 0603; Temperature Coeffcient: 100ppm/C; Type: RES SMD; MCHP-ID: RSMT0518; Supplier 1: Digi-Key; Supplier Part Number 1: 311-470HRCT-ND; ComponentLink1Description: Datasheet; ComponentLink1URL: https://chn-vm-apps.microchip.com/mchprepo/parts/Datasheets/PYu-RC0603_51_RoHS_L_4.pdf; Status: Production; Quantity Override: 1; Revision: 1; Operating Temperature: -55C to +155C; Category: Resistor; Composition: TKF; Manufacturer 2: Panasonic; Manufacturer Part Number 2: ERJ-3EKF4700V; Manufacturer 3: Stackpole Electronics Inc; Manufacturer Part Number 3: RMCF0603FT470R; Supplier 2: Digi-Key; Supplier Part Number 2: P470HCT-ND; Supplier 3: Digi-Key; Supplier Part Number 3: RMCF1/16470FRTR-ND
U9 = MIC9437: Manufacturer 1: Microchip Technology; Description_: MCHP MCU 16-BIT 100MIPS 256kB 24kB dsPIC33CDVC256MP506-E/M9; Dev Tools Status: Design; Owner: Narasimha Murthy; Populated: YES; MCHP-ID: MIC9437; Symbol: dsPIC33CDVC256MP506_VGQFN-64; Type: 16-Bit; Status: MCL Design; Revision: 1; Category: MCHP-Microcontroller; ComponentLink1URL: https://www.microchip.com/sitesearch/search/Product%20and%20Development%20Tools/dsPIC33CDVC256MP506-E/M9; ComponentLink1Description: SVN Datasheet; ComponentLink2Description: Local Datasheet; ComponentLink3URL: C:\ALTIUM_WORK\00001_MCHP-CDB\Library\LibraryRefs\dsPIC33CDVC256MP506_VGQFN-64.SchLib; ComponentLink3Description: Open Symbol; ComponentLink4URL: C:\ALTIUM_WORK\00001_MCHP-CDB\Library\Footprints\QFN-64_9X9_3EP_M9.PcbLib; ComponentLink4Description: Open Footprint; ComponentLink5Description: Open Footprint 2; ComponentLink6Description: Open Footprint 3; ComponentLink7Description: Open Footprint 4; Manufacturer Part Number 1: dsPIC33CDVC256MP506-E/M9; Supplier 1: Microchip Technology; Supplier Part Number 1: dsPIC33CDVC256MP506-E/M9; Operating Temperature: -40C to +125C; Quantity Override: 1